# Altium project DIOT_Sampler.PrjPCB (part 5 of 5)

## Sheet CPCIS_Connectors_P1_P6.SchDoc
size 420 x 297 mm; Organization: WUT; DocumentNumber: 1; SheetNumber: 10; Title2: CPCIS Connectors; SPICEModelCacheRMUUFYQV: <root> / <DocumentId>RMUUFYQV</DocumentId> / </root>; ModifiedDate: -; Rule: PcbType=ProtelPcb; ProjectName: DIOT_Sampler.PrjPCB
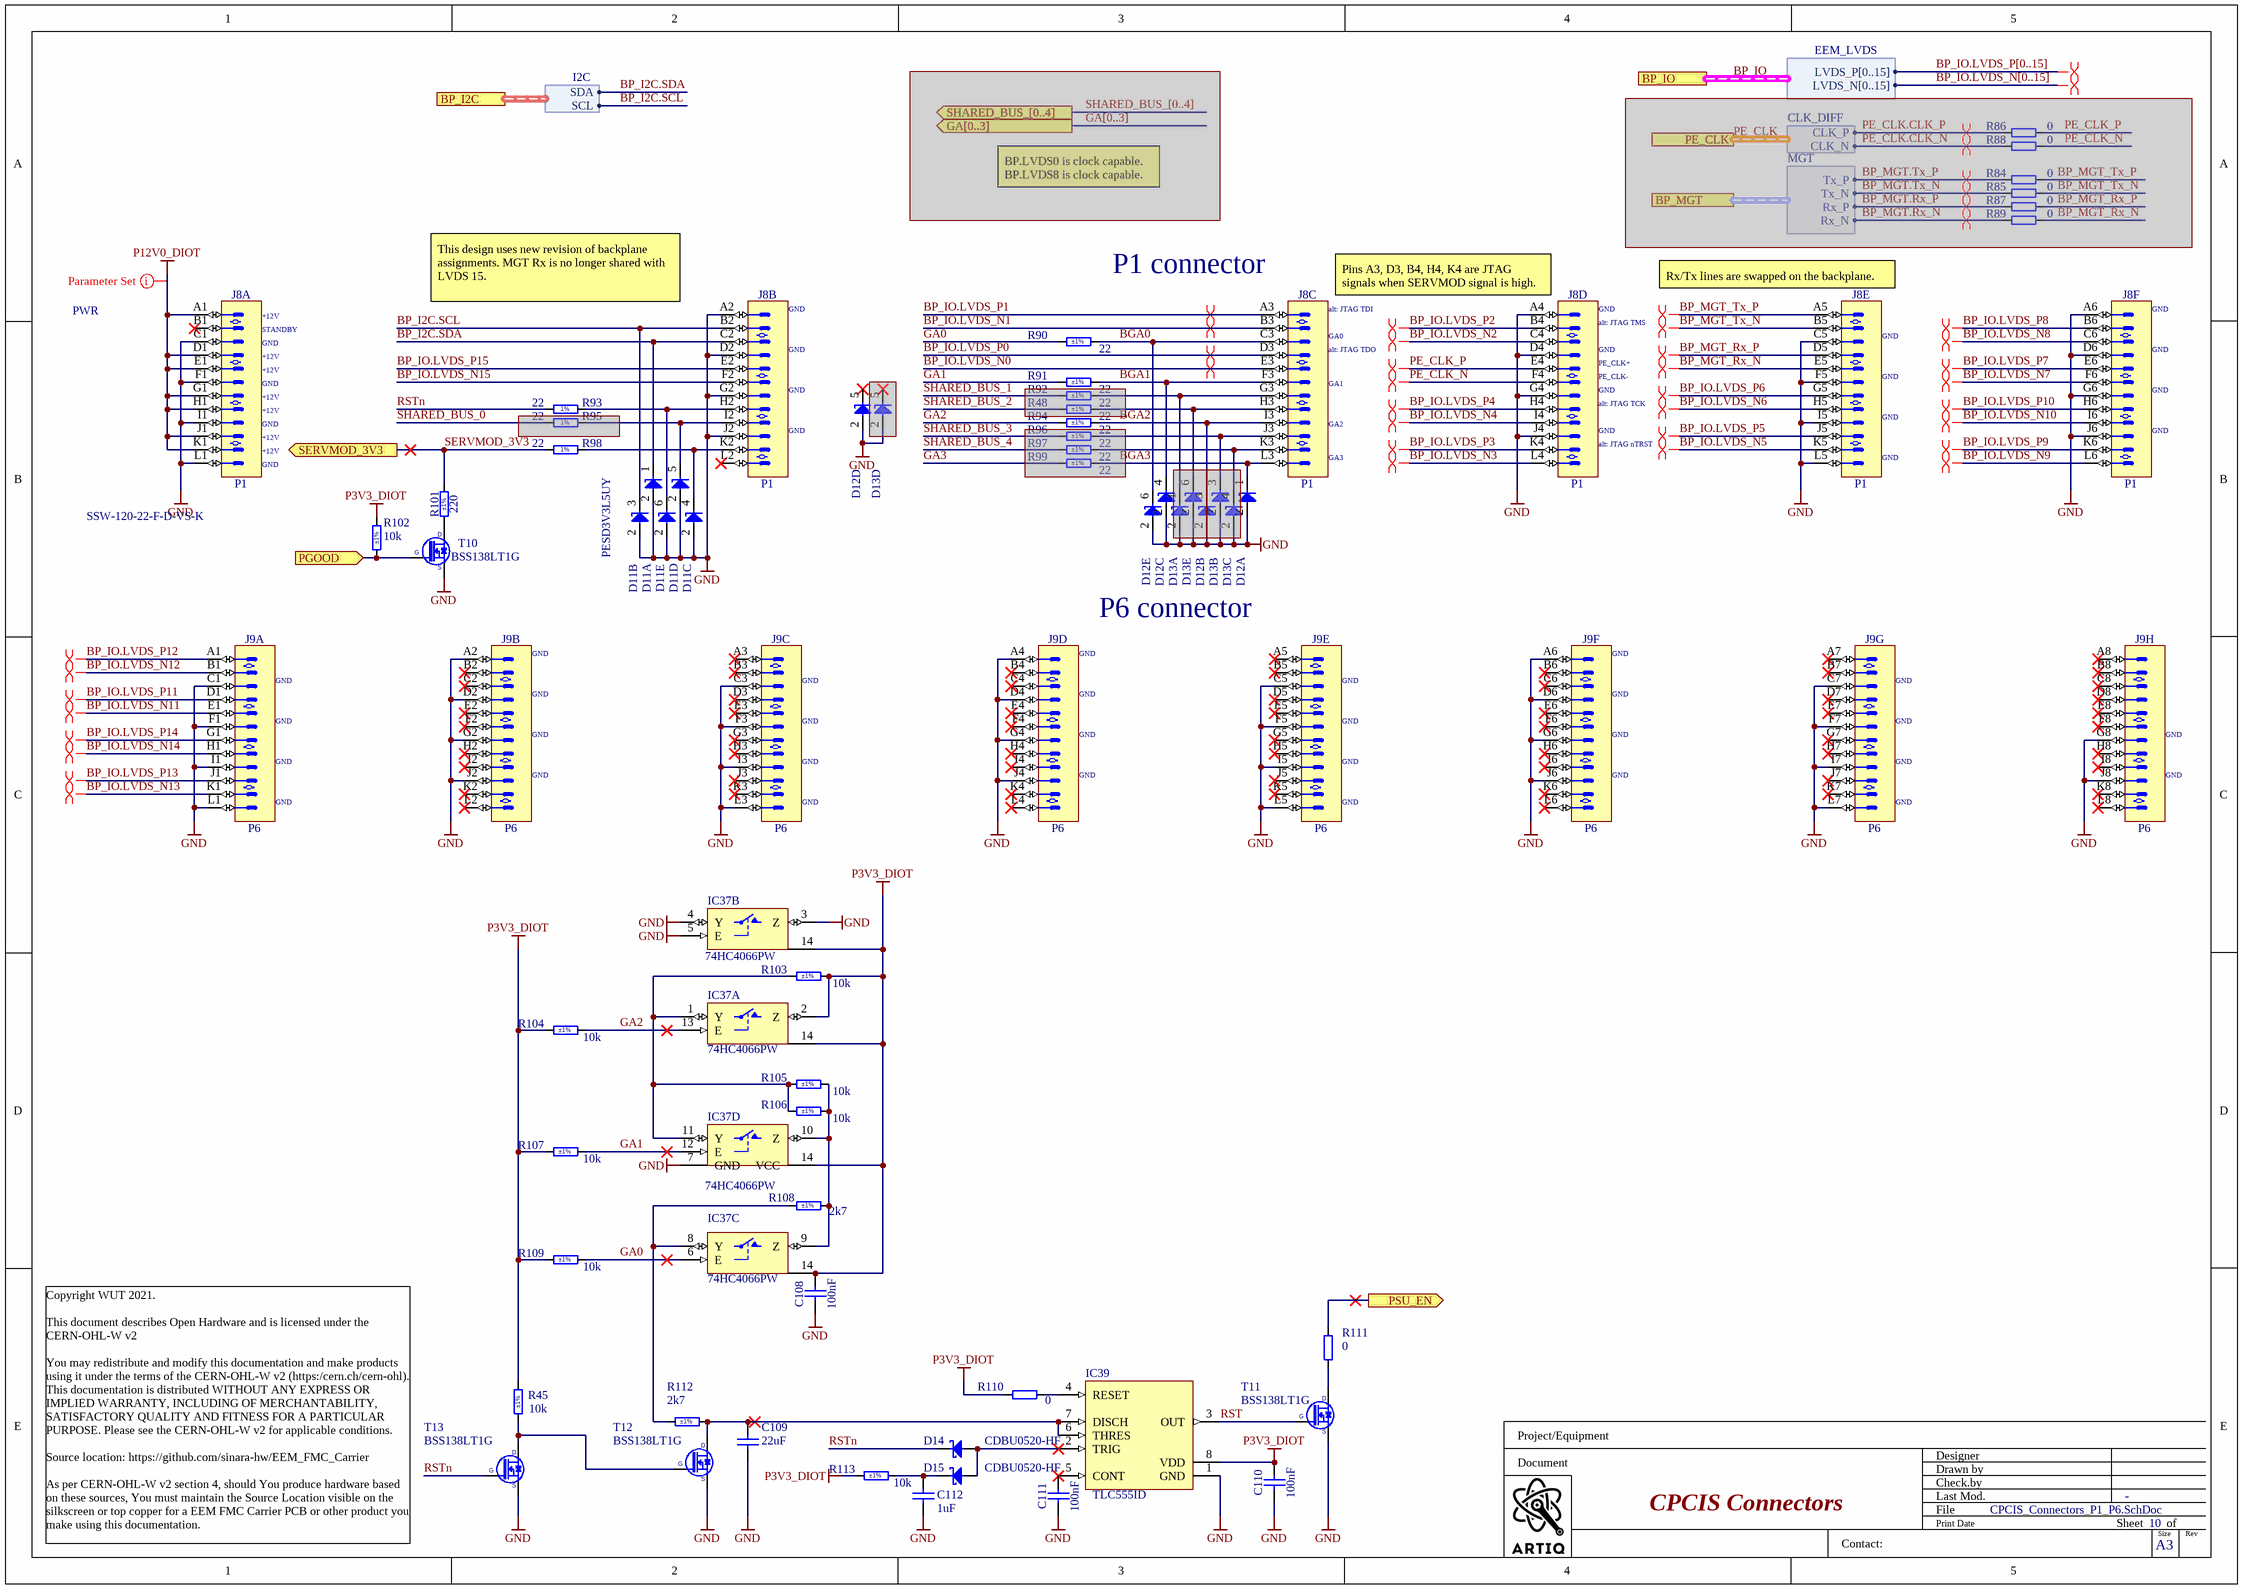
[diagram p6: CPCIS_Connectors_P1_P6.SchDoc]

### Parts
(Parts that share a designator on the sheet are numbered #1, #2 ... from top to bottom, then left to right.)
C108  100nF  [CAPC1005X55N]
C109  22uF  [CAPC2012X135N]
C110  100nF  [CAPC1005X55N]
C111  100nF  [CAPC1005X55N]
C112  1uF  [CAPC1005X55N]
D11  PESD3V3L5UY  [SOT65P210X110-6N]  (value not drawn)  (parts A,B,C,D,E of 5)
D12  PESD3V3L5UY  [SOT65P210X110-6N]  (value not drawn)  (parts A,B,C,D,E of 5)
D13  PESD3V3L5UY  [SOT65P210X110-6N]  (value not drawn)  (parts A,B,C,D,E of 5)  (masked out: inside a compile mask, not in the netlist)
D14  CDBU0520-HF  [SOD-523F]
D15  CDBU0520-HF  [SOD-523F]
IC37  74HC4066PW  [SOP65P640X110-14N]  (parts A,B,C,D of 4)
IC39  TLC555ID  [SOIC127P600X175-8N]
J8  P1  [AMPHENOL_10052825-101LF]  (parts A,B,C,D,E,F of 6)
J9  P6  [AMPHENOL_10052838-101LF]  (parts A,B,C,D,E,F,G,H of 8)
R45  10k  Tolerance: ±1%  [RESC1005X40N]
R48  22  Tolerance: ±1%  [RESC1005X40N]  (masked out: inside a compile mask, not in the netlist)
R84  0  [RESC1005X40N]  (masked out: inside a compile mask, not in the netlist)
R85  0  [RESC1005X40N]  (masked out: inside a compile mask, not in the netlist)
R86#2  0  [RESC1005X40N]  (masked out: inside a compile mask, not in the netlist)
R87  0  [RESC1005X40N]  (masked out: inside a compile mask, not in the netlist)
R88  0  [RESC1005X40N]  (masked out: inside a compile mask, not in the netlist)
R89  0  [RESC1005X40N]  (masked out: inside a compile mask, not in the netlist)
R90  22  Tolerance: ±1%  [RESC1005X40N]
R91  22  Tolerance: ±1%  [RESC1005X40N]
R92  22  Tolerance: ±1%  [RESC1005X40N]  (masked out: inside a compile mask, not in the netlist)
R93  22  [RESC1005X40N]
R94  22  Tolerance: ±1%  [RESC1005X40N]
R95  22  [RESC1005X40N]  (masked out: inside a compile mask, not in the netlist)
R96  22  Tolerance: ±1%  [RESC1005X40N]  (masked out: inside a compile mask, not in the netlist)
R97  22  Tolerance: ±1%  [RESC1005X40N]  (masked out: inside a compile mask, not in the netlist)
R98  22  [RESC1005X40N]
R99  22  Tolerance: ±1%  [RESC1005X40N]  (masked out: inside a compile mask, not in the netlist)
R101  220  Tolerance: ±1%  [RESC1005X40N]
R102  10k  Tolerance: ±1%  [RESC1005X40N]
R103  10k  Tolerance: ±1%  [RESC1005X40N]
R104  10k  Tolerance: ±1%  [RESC1005X40N]
R105  10k  Tolerance: ±1%  [RESC1005X40N]
R106  10k  Tolerance: ±1%  [RESC1005X40N]
R107  10k  Tolerance: ±1%  [RESC1005X40N]
R108  2k7  Tolerance: ±1%  [RESC1005X40N]
R109  10k  Tolerance: ±1%  [RESC1005X40N]
R110  0  [RESC1005X40N]
R111  0  [RESC1005X40N]
R112  2k7  Tolerance: ±1%  [RESC1005X40N]
R113  10k  Tolerance: ±1%  [RESC1005X40N]
T10  BSS138LT1G  [SOT95P240X110-3N]
T11  BSS138LT1G  [SOT95P240X110-3N]
T12  BSS138LT1G  [SOT95P240X110-3N]
T13  BSS138LT1G  [SOT95P240X110-3N]

### Ports
BP_I2C (harness I2C), BP_IO (harness EEM_LVDS), BP_MGT (harness MGT), GA[0..3] (out), PE_CLK (harness CLK_DIFF), PGOOD (in), PSU_EN (out), SERVMOD_3V3 (out), SHARED_BUS_[0..4] (out)

### Harnesses
MGT: Tx_P, Tx_N, Rx_P, Rx_N
CLK_DIFF: CLK_N, CLK_P
I2C: SDA, SCL
EEM_LVDS: LVDS_P[0..15], LVDS_N[0..15]

### Nets
GND: C108.1 C109.1 C110.1 C111.1 C112.1 D11.2(A) D12.2(A) IC37.3(Z) IC37.4(Y) IC37.5(E) IC37.7(GND) IC39.1(GND) J8.A2 J8.A4 J8.A6 J8.C1 J8.C5 J8.D2 J8.D4 J8.D6 J8.F1 J8.F5 J8.G2 J8.G4 J8.G6 J8.I1 J8.I5 J8.J2 J8.J4 J8.J6 J8.L1 J8.L5 J9.A2 J9.A4 J9.A6 J9.C1 J9.C3 J9.C5 J9.C7 J9.D2 J9.D4 J9.D6 J9.F1 J9.F3 J9.F5 J9.F7 J9.G2 J9.G4 J9.G6 J9.G8 J9.I1 J9.I3 J9.I5 J9.I7 J9.J2 J9.J4 J9.J6 J9.J8 J9.L1 J9.L3 J9.L5 J9.L7 T10.2(S) T11.2(S) T12.2(S) T13.2(S)
P3V3_DIOT: C108.2 C110.2 IC37.2(Z) IC37.14(VCC) IC39.8(VDD) R45.1 R102.2 R103.2 R104.1 R107.1 R109.1 R110.1 R113.1
P12V0_DIOT: J8.A1 J8.D1 J8.E1 J8.G1 J8.H1 J8.J1 J8.K1
BGA0: D12.6(C) J8.C3 R90.2
BGA1: D12.4(C) J8.F3 R91.2
BGA2: J8.I3 R94.2
BP_I2C.SCL: D11.3(C) J8.B2 ; port BP_I2C.SCL
BP_I2C.SDA: D11.1(C) J8.C2 ; port BP_I2C.SDA
BP_IO.LVDS_N0: J8.E3
BP_IO.LVDS_N1: J8.B3
BP_IO.LVDS_N2: J8.C4
BP_IO.LVDS_N3: J8.L4
BP_IO.LVDS_N4: J8.I4
BP_IO.LVDS_N5: J8.K5
BP_IO.LVDS_N6: J8.H5
BP_IO.LVDS_N7: J8.F6
BP_IO.LVDS_N8: J8.C6
BP_IO.LVDS_N9: J8.L6
BP_IO.LVDS_N10: J8.I6
BP_IO.LVDS_N11: J9.E1
BP_IO.LVDS_N12: J9.B1
BP_IO.LVDS_N13: J9.K1
BP_IO.LVDS_N14: J9.H1
BP_IO.LVDS_N15: J8.F2
BP_IO.LVDS_P0: J8.D3
BP_IO.LVDS_P1: J8.A3
BP_IO.LVDS_P2: J8.B4
BP_IO.LVDS_P3: J8.K4
BP_IO.LVDS_P4: J8.H4
BP_IO.LVDS_P5: J8.J5
BP_IO.LVDS_P6: J8.G5
BP_IO.LVDS_P7: J8.E6
BP_IO.LVDS_P8: J8.B6
BP_IO.LVDS_P9: J8.K6
BP_IO.LVDS_P10: J8.H6
BP_IO.LVDS_P11: J9.D1
BP_IO.LVDS_P12: J9.A1
BP_IO.LVDS_P13: J9.J1
BP_IO.LVDS_P14: J9.G1
BP_IO.LVDS_P15: J8.E2
BP_MGT_Rx_N: J8.E5
BP_MGT_Rx_P: J8.D5
BP_MGT_Tx_N: J8.B5
BP_MGT_Tx_P: J8.A5
GA0: IC37.6(E) R90.1 R109.2
GA1: IC37.12(E) R91.1 R107.2
GA2: IC37.13(E) R94.1 R104.2
PE_CLK_N: J8.F4
PE_CLK_P: J8.E4
PSU_EN: R111.2 ; port PSU_EN
RST: IC39.3(OUT) T11.1(G)
RSTn: D14.1(C) R93.1 T13.1(G)
SERVMOD_3V3: R98.1 R101.2 ; port SERVMOD_3V3
NetC109_2: C109.2 IC39.6(THRES) IC39.7(DISCH) R112.2 T12.3(D)
NetC111_2: C111.2 IC39.5(CONT)
NetC112_2: C112.2 D15.1(C) R113.2
NetD11_4: D11.4(C) J8.K2 R98.2
NetD11_5: D11.5(C) J8.I2
NetD11_6: D11.6(C) J8.H2 R93.2
NetD12_1: D12.1(C) J8.L3
NetD14_2: D14.2(A) D15.2(A) IC39.2(TRIG)
NetIC37_1: IC37.1(Y) IC37.11(Y) R103.1 R105.1 R106.1
NetIC37_8: IC37.8(Y) R108.1 R112.1
NetIC37_9: IC37.9(Z) IC37.10(Z) R105.2 R106.2 R108.2
NetIC39_4: IC39.4(RESET) R110.2
NetR45_2: R45.2 T12.1(G) T13.3(D)
NetR101_1: R101.1 T10.3(D)
NetR102_1: R102.1 T10.1(G) ; port PGOOD
NetR111_1: R111.1 T11.3(D)

Not connected (* = marked no-connect by the designer): D12 5(C)*; J8 B1* G3 H3 J3 K3 L2*; J9 A3* A5* A7* A8* B2* B3* B4* B5* B6* B7* B8* C2* C4* C6* C8* D3* D5* D7* D8* E2* E3* E4* E5* E6* E7* E8* F2* F4* F6* F8* G3* G5* G7* H2* H3* H4* H5* H6* H7* H8* I2* I4* I6* I8* J3* J5* J7* K2* K3* K4* K5* K6* K7* K8* L2* L4* L6* L8*

### Buses and harness runs
bus BP_IO.LVDS_N[0..15]
bus BP_IO.LVDS_P[0..15]
harness BP_IO = port BP_IO

### Layout directives
differential pair: (no net found under the mark), BP_IO.LVDS_N0, BP_IO.LVDS_N1, BP_IO.LVDS_N2, BP_IO.LVDS_N3, BP_IO.LVDS_N4, BP_IO.LVDS_N5, BP_IO.LVDS_N6, BP_IO.LVDS_N7, BP_IO.LVDS_N8, BP_IO.LVDS_N9, BP_IO.LVDS_N10, BP_IO.LVDS_N11, BP_IO.LVDS_N12, BP_IO.LVDS_N13, BP_IO.LVDS_N14, BP_IO.LVDS_P0, BP_IO.LVDS_P1, BP_IO.LVDS_P2, BP_IO.LVDS_P3, BP_IO.LVDS_P4, BP_IO.LVDS_P5, BP_IO.LVDS_P6, BP_IO.LVDS_P7, BP_IO.LVDS_P8, BP_IO.LVDS_P9, BP_IO.LVDS_P10, BP_IO.LVDS_P11, BP_IO.LVDS_P12, BP_IO.LVDS_P13, BP_IO.LVDS_P14
differential pair; differential pair class Diff_100Ohm: (no net found under the mark), PE_CLK_N, PE_CLK_P
differential pair; differential pair class MGT: (no net found under the mark), BP_MGT_Rx_N, BP_MGT_Rx_P, BP_MGT_Tx_N, BP_MGT_Tx_P
net class PWR: P12V0_DIOT

### Notes on the sheet
- BP.LVDS0 is clock capable.
  BP.LVDS8 is clock capable.
- (near J8) +12V
- This design uses new revision of backplane assignments. MGT Rx is no longer shared with LVDS 15.
- (near J8) GND
- (near J8) P1 connector
- (near J8) alt: JTAG TDI
- (near J8) Pins A3, D3, B4, H4, K4 are JTAG signals when SERVMOD signal is high.
- (near J8) alt: JTAG TMS
- (near J8) Rx/Tx lines are swapped on the backplane.
- (near J8) STANDBY
- GND
- (near J8) alt: JTAG TDO
- (near J8) GA1
- (near J8) GA0
- (near J8) PE_CLK+
- (near J8) PE_CLK-
- (near J8) GA2
- (near J8) GA3
- (near J8) alt: JTAG TCK
- (near J8) alt: JTAG nTRST
- (near J8) SSW-120-22-F-D-VS-K
- (near J9) GND
- (near J9) P6 connector
- Project/Equipment
- Document
- Designer
- Drawn by
- Check.by
- Copyright WUT 2021.
  This document describes Open Hardware and is licensed under the CERN-OHL-W v2
  You may redistribute and modify this documentation and make products using it under the terms of the CERN-OHL-W v2 (https:/cern.ch/cern-ohl). This documentation is distributed WITHOUT ANY EXPRESS OR IMPLIED WARRANTY, INCLUDING OF MERCHANTABILITY, SATISFACTORY QUALITY AND FITNESS FOR A PARTICULAR PURPOSE. Please see the CERN-OHL-W v2 for applicable conditions.
  Source location: https://github.com/sinara-hw/EEM_FMC_Carrier
  As per CERN-OHL-W v2 section 4, should You produce hardware based on these sources, You must maintain the Source Location visible on the silkscreen or top copper for a EEM FMC Carrier PCB or other product you make using this documentation.
- Contact:
- File
- Last Mod.
- Print Date
- Sheet
- Size
- A3
- of
- Rev
- (in symbol R0402_22R_1%_0.0625W_100PPM) 1%

### Library data of the parts
C108 C110 C111 = CC0402_100NF_16V_10%_X5R: Non-polarised capacitor; Part Description: SMD Multilayer Chip Ceramic Capacitor; Manufacturer: GENERIC; Manufacturer1 Part Number: GRM155R61C104KA88D; Voltage: 16V; TC: X5R; Tolerance: ±10%; Part Number: CC0402_100NF_16V_10%_X5R; Component Kind: Standard; Component Type: Standard; Pin Count: 2; Value: 100nF; Status: None; Manufacturer Part Number: CC0402_100NF_16V_10%_X5R; Case: 0402; Mounted: Yes; Socket: No; SMD: Yes; Sense: No; Manufacturer1 Example: MURATA; Manufacturer1 ComponentHeight: 0.55mm; HelpURL: \\cern.ch\dfs\Applications\Altium\Datasheets\CC0402_X5R_MURATA_GRM.pdf; Author: CERN DEM JLC; CreateDate: 10.12.2013; LatestRevisionDate: 10.12.2013
C109 = CC0805_22UF_16V_10%_X5R: Non-polarised capacitor; Part Description: SMD Multilayer Chip Ceramic Capacitor; Manufacturer: GENERIC; Manufacturer1 Part Number: C2012X5R1C226KT; Voltage: 16V; TC: X5R; Tolerance: ±10%; Part Number: CC0805_22UF_16V_10%_X5R; Component Kind: Standard; Component Type: Standard; Pin Count: 2; Value: 22uF; Status: Preferred; Manufacturer Part Number: CC0805_22UF_16V_10%_X5R; Case: 0805; Mounted: Yes; Socket: No; SMD: Yes; Sense: No; Manufacturer1 Example: TDK; Manufacturer1 ComponentHeight: 1.35mm; HelpURL: \\cern.ch\dfs\Applications\Altium\Datasheets\CC0805_X5R_TDK_C.pdf; Author: CERN DEM JLC; CreateDate: 25.10.2012; LatestRevisionDate: 25.10.2012
C112 = CC0402_1UF_16V_10%_X5R: Non-polarised capacitor; Part Description: SMD Multilayer Chip Ceramic Capacitor; Manufacturer: GENERIC; Manufacturer1 Part Number: C1005X5R1C105KT; Voltage: 16V; TC: X5R; Tolerance: ±10%; Part Number: CC0402_1UF_16V_10%_X5R; Component Kind: Standard; Component Type: Standard; Pin Count: 2; Value: 1uF; Status: Preferred; Manufacturer Part Number: CC0402_1UF_16V_10%_X5R; Case: 0402; Mounted: Yes; Socket: No; SMD: Yes; Sense: No; Manufacturer1 Example: TDK; Manufacturer1 ComponentHeight: 0.55mm; HelpURL: \\cern.ch\dfs\Applications\Altium\Datasheets\CC0402_X5R_TDK_C.pdf; Author: CERN DEM JLC; CreateDate: 25.10.2012; LatestRevisionDate: 25.10.2012
D11-D13 = PESD3V3L5UY: Fivefold ESD Protection Diode Arrays; Part Description: Fivefold ESD Protection Diode Arrays (30kV); Manufacturer: NEXPERIA; Voltage: 3.3V; Power: 200W; PressFit: No; Bonding: No; Part Number: PESD3V3L5UY; Component Kind: Standard; Component Type: Standard; Device: PESD3V3L5UY; PackageDescription: SOT363, SC-88, 0.65mm Pitch; 6 Pin, 1.25mm W X 2.00mm L X 1.10mm H body, IPC Medium Density; Manufacturer Part Number: PESD3V3L5UY; Pin Count: 6; Case: SOT363; Mounted: Yes; Socket: No; SMD: Yes; Sense: No; ComponentHeight: 1.1mm; HelpURL: \\cern.ch\dfs\Applications\Altium\Datasheets\PESD3V3L5UY.pdf; Author: CERN DEM WB; CreateDate: 05.07.2021; LatestRevisionDate: 05.07.2021
D14 D15 = CDBU0520-HF: Schottky Diode; Part Description: 20V Surface mount Schottky Barrier Diode; Manufacturer: COMCHIP; Voltage: 20V; Power: 500mA; PressFit: No; Bonding: No; Part Number: CDBU0520-HF; Component Kind: Standard; Component Type: Standard; Device: CDBU0520-HF; PackageDescription: Small Outline Diode Flat Lead (SOD-523F), Body; 1.80mm L X 1mm W X 0.85mm H; Manufacturer Part Number: CDBU0520-HF; Pin Count: 2; Case: SOD-523F; Mounted: Yes; Socket: No; SMD: Yes; Sense: No; ComponentHeight: 1mm; HelpURL: \\cern.ch\dfs\Applications\Altium\Datasheets\CDBU0520-HF.pdf; Author: CERN DEM HF; CreateDate: 13.10.2023; LatestRevisionDate: 13.10.2023
IC37 = 74HC4066PW: Part Description: Quad Single-Pole Single-Throw Analog Switch; Manufacturer: NXP SEMICONDUCTORS; PressFit: No; Bonding: No; Table: Standard Logic; Part Number: 74HC4066PW; Component Kind: Standard; Component Type: Standard; Device: 74HC4066PW; PackageDescription: SOP, 14-Leads, Body 4.4x5mm (max), Pitch 0.65mm, IPC Medium Density; Manufacturer Part Number: 74HC4066PW; Pin Count: 14; Case: TSSOP14; Mounted: Yes; Socket: No; SMD: Yes; ComponentHeight: 1.1mm; Author: CERN DEM JLC; HelpURL: \\cern.ch\dfs\Applications\Altium\Datasheets\74HC4066PW.pdf; CreateDate: 2014-11-19; LatestRevisionDate: 2014-11-19
IC39 = TLC555ID: LinCMOS Timer; Manufacturer: TEXAS INSTRUMENTS; PressFit: No; Bonding: No; Part Number: TLC555ID; Component Kind: Standard; Component Type: Standard; Device: TLC555ID; PackageDescription: SOIC 8, Pitch 1.27mm, Body 4x5mm, IPC Medium Density; Part Description: LinCMOS Timer; Manufacturer Part Number: TLC555ID; Pin Count: 8; Case: SOIC8; Mounted: Yes; Socket: No; SMD: Yes; Sense: No; ComponentHeight: 1.75mm; Author: CERN DEM JMW; HelpURL: \\cern.ch\dfs\Applications\Altium\Datasheets\TLC555ID.pdf; CreateDate: 23.08.2016; LatestRevisionDate: 23.08.2016
J8 = AMPHENOL_10052825-101LF: 72 Contacts Header, 6 Columns, 4 Pairs per Column; Part Description: 72 Contacts, 2mm Pitch, 6 Columns, 4 Pairs per Column, 4 Walls, Right Angle Header; Part Number: AMPHENOL_10052825-101LF; Component Kind: Standard; Component Type: Standard; Pin Count: 72; Family: AirMax VS; Mounted: Yes; Socket: No; SMD: No; PressFit: Yes; Sense: No; Status: None; Manufacturer: AMPHENOL; Manufacturer Part Number: 10052825-101LF; ComponentHeight: 15.35mm; HelpURL: \\cern.ch\dfs\Applications\Altium\Datasheets\AMPHENOL_10052825-101LF.pdf; ComponentLink1URL: \\cern.ch\dfs\Applications\Altium\Datasheets\AMPHENOL_10052825-101LF_Application.pdf; ComponentLink1Description: Application; Author: CERN DEM MR; CreateDate: 19/02/2018; LatestRevisionDate: 19/02/2018; Classname: Overlapping
J9 = AMPHENOL_10052838-101LF: 96 Contacts Header, 8 Columns, 4 Pairs per Column; Part Description: 96 Contacts, 2mm Pitch, 8 Columns, 4 Pairs per Column, 4 Walls, Right Angle Header; Part Number: AMPHENOL_10052838-101LF; Component Kind: Standard; Component Type: Standard; Pin Count: 96; Family: AirMax VS; Mounted: Yes; Socket: No; SMD: No; PressFit: Yes; Sense: No; Status: None; Manufacturer: AMPHENOL; Manufacturer Part Number: 10052838-101LF; ComponentHeight: 15.35mm; HelpURL: \\cern.ch\dfs\Applications\Altium\Datasheets\AMPHENOL_10052838-101LF.pdf; ComponentLink1URL: \\cern.ch\dfs\Applications\Altium\Datasheets\AMPHENOL_10052838-101LF_Application.pdf; ComponentLink1Description: Application; Author: CERN DEM MR; CreateDate: 19.02.2018; LatestRevisionDate: 19.02.2018
R45 R102-R107 R109 R113 = R0402_10K_1%_0.0625W_100PPM: Resistor - 1%; Part Description: General Purpose Thick Film Chip Resistor; Manufacturer: GENERIC; Manufacturer1 Part Number: 232270671003L; TC: ±100ppm/°C; PressFit: No; Part Number: R0402_10K_1%_0.0625W_100PPM; Component Kind: Standard; Component Type: Standard; Pin Count: 2; Value: 10k; Status: Not Recommended; Power: 0.0625W; Manufacturer Part Number: R0402_10K_1%_0.0625W_100PPM; Case: 0402; Mounted: Yes; Sense: No; Socket: No; SMD: Yes; Manufacturer1 Example: YAGEO PHYCOMP; Manufacturer1 ComponentHeight: 0.4mm; HelpURL: \\cern.ch\dfs\Applications\Altium\Datasheets\R0402_Phycomp_RC0402.pdf; Author: CERN DEM JLC; CreateDate: 03.12.2007; LatestRevisionDate: 17.10.2012
R48 R90-R92 R94 R96 R97 R99 = R0402_22R_1%_0.0625W_100PPM: Resistor - 1%; Part Description: General Purpose Thick Film Chip Resistor; Manufacturer: GENERIC; Manufacturer1 Part Number: 232270672209L; TC: ±100ppm/°C; PressFit: No; Part Number: R0402_22R_1%_0.0625W_100PPM; Component Kind: Standard; Component Type: Standard; Pin Count: 2; Value: 22; Status: Not Recommended; Power: 0.0625W; Manufacturer Part Number: R0402_22R_1%_0.0625W_100PPM; Case: 0402; Mounted: Yes; Sense: No; Socket: No; SMD: Yes; Manufacturer1 Example: YAGEO PHYCOMP; Manufacturer1 ComponentHeight: 0.4mm; HelpURL: \\cern.ch\dfs\Applications\Altium\Datasheets\R0402_Phycomp_RC0402.pdf; Author: CERN DEM JLC; CreateDate: 03.12.2007; LatestRevisionDate: 17.10.2012
R84 R85 R86#2 R87-R89 R110 R111 = R0402_0R_JUMPER: Resistor; Part Description: 1A (0.05R Max DC Resistance) Zero Ohm Jumper; Manufacturer: GENERIC; Manufacturer1 Part Number: 232270591001L; PressFit: No; Part Number: R0402_0R_JUMPER; Component Kind: Standard; Component Type: Standard; Pin Count: 2; Value: 0; Status: Not Recommended; Manufacturer Part Number: R0402_0R_JUMPER; Case: 0402; Mounted: Yes; Sense: No; Socket: No; SMD: Yes; Manufacturer1 Example: YAGEO PHYCOMP; Manufacturer1 ComponentHeight: 0.4mm; HelpURL: \\cern.ch\dfs\Applications\Altium\Datasheets\R0402_Phycomp_RC0402.pdf; Author: CERN DEM JLC; CreateDate: 03.12.2007; LatestRevisionDate: 17.10.2012
R93 R95 R98 = R0402_22R_1%_0.0625W_100PPM: Resistor - 1%; Part Description: General Purpose Thick Film Chip Resistor; Manufacturer: GENERIC; Manufacturer1 Part Number: 232270672209L; PressFit: No; Part Number: R0402_22R_1%_0.0625W_100PPM; Component Kind: Standard; Component Type: Standard; Pin Count: 2; Value: 22; Status: Not Recommended; Power: 0.0625W; Tolerance: ±1%; Manufacturer Part Number: R0402_22R_1%_0.0625W_100PPM; Case: 0402; Mounted: Yes; Socket: No; SMD: Yes; Manufacturer1 Example: YAGEO PHYCOMP; Manufacturer1 ComponentHeight: 0.4mm; HelpURL: \\cern.ch\dfs\Applications\Altium\Datasheets\R0402_Phycomp_RC0402.pdf; Author: CERN DEM JLC; CreateDate: 03.12.2007; LatestRevisionDate: 17.10.2012; Sense: No
R101 = R0402_220R_1%_0.0625W_100PPM: Resistor - 1%; Part Description: General Purpose Thick Film Chip Resistor; Manufacturer: GENERIC; Manufacturer1 Part Number: 232270672201L; TC: ±100ppm/°C; PressFit: No; Part Number: R0402_220R_1%_0.0625W_100PPM; Component Kind: Standard; Component Type: Standard; Pin Count: 2; Value: 220; Status: Not Recommended; Power: 0.0625W; Manufacturer Part Number: R0402_220R_1%_0.0625W_100PPM; Case: 0402; Mounted: Yes; Sense: No; Socket: No; SMD: Yes; Manufacturer1 Example: YAGEO PHYCOMP; Manufacturer1 ComponentHeight: 0.4mm; HelpURL: \\cern.ch\dfs\Applications\Altium\Datasheets\R0402_Phycomp_RC0402.pdf; Author: CERN DEM JLC; CreateDate: 03.12.2007; LatestRevisionDate: 17.10.2012
R108 R112 = R0603_2K7_1%_0.1W_100PPM: Resistor - 1%; Part Description: General Purpose Thick Film Chip Resistor; Manufacturer: GENERIC; Manufacturer1 Part Number: RC0603FR-072K7L; Power: 0.1W; TC: ±100ppm/°C; PressFit: No; Part Number: R0603_2K7_1%_0.1W_100PPM; Component Kind: Standard; Component Type: Standard; Footprint: RESC1608X55N; Pin Count: 2; Value: 2k7; Status: Preferred; Manufacturer Part Number: R0603_2K7_1%_0.1W_100PPM; Case: 0603; Mounted: Yes; Sense: No; Socket: No; SMD: Yes; Manufacturer1 Example: YAGEO PHYCOMP; Manufacturer1 ComponentHeight: 0.55mm; HelpURL: \\cern.ch\dfs\Applications\Altium\Datasheets\R0603_PHYCOMP_RC0603.pdf; Author: CERN DEM JLC; CreateDate: 02.05.2011; LatestRevisionDate: 02.05.2011
T10-T13 = BSS138LT1G: N-CHANNEL MOSFET WITH DIODE; Part Description: 50V, 200mA N-Channel Enhancement Mode Field-Effect Transistor; Manufacturer: ON SEMICONDUCTOR; PressFit: No; Bonding: No; Part Number: BSS138LT1G; Component Kind: Standard; Component Type: Standard; Device: BSS138LT1G; PackageDescription: SOT23, 0.95mm Pitch; 3 Pin, 1.40mm W X 3.00mm L X 1.10mm H body, IPC Medium Density; Manufacturer Part Number: BSS138L; Pin Count: 3; Case: SOT23-3; Mounted: Yes; Socket: No; SMD: Yes; Sense: No; ComponentHeight: 1.11mm; HelpURL: \\cern.ch\dfs\Applications\Altium\Datasheets\BSS138LT1G.pdf; Author: CERN DEM JLC; CreateDate: 23.03.2009; LatestRevisionDate: 25.05.2022

## Nets that join several sheets
GND: Sampler (49 pins), ADC_8CH (41 pins), EEM_Connectors (77 pins), Supply_Sampler (78 pins), U_Input_channel (17 pins), U_Input_channel (17 pins), U_Input_channel (17 pins), U_Input_channel (17 pins), U_Input_channel (17 pins), U_Input_channel (17 pins), U_Input_channel (17 pins), U_Input_channel (17 pins), DIOT_Power_Supplies (14 pins), CPCIS_Connectors_P1_P6 (66 pins)
N12V0A: ADC_8CH (C105.2 IC35.4), Supply_Sampler (9 pins), U_Input_channel (8 pins), U_Input_channel (8 pins), U_Input_channel (8 pins), U_Input_channel (8 pins), U_Input_channel (8 pins), U_Input_channel (8 pins), U_Input_channel (8 pins), U_Input_channel (8 pins)
N13V0: Sampler (R42.2), Supply_Sampler (7 pins)
P2V5A: ADC_8CH (7 pins), EEM_Connectors (C16.2 IC7.1), Supply_Sampler (8 pins)
P3V3: Sampler (23 pins), EEM_Connectors (33 pins), Supply_Sampler (10 pins)
P3V3_DIOT: DIOT_Power_Supplies (C118.1 D17.2 IC41.5), CPCIS_Connectors_P1_P6 (13 pins)
P3V3_MP: EEM_Connectors (9 pins), DIOT_Power_Supplies (7 pins)
P3V3_MP2: Sampler (D22.2), EEM_Connectors (5 pins)
P5V0A: ADC_8CH (10 pins), Supply_Sampler (6 pins)
P12V0: Sampler (R86#1.2), EEM_Connectors (8 pins), Supply_Sampler (C57.2 IC27.8 L4.1), DIOT_Power_Supplies (6 pins)
P12V0_DIOT: EEM_Connectors (R100.1 R154.1 R155.1 R156.1), DIOT_Power_Supplies (C117.2 IC41.1 IC41.3), CPCIS_Connectors_P1_P6 (7 pins)
P12V0A: ADC_8CH (C104.2 IC35.8), Supply_Sampler (7 pins), U_Input_channel (7 pins), U_Input_channel (7 pins), U_Input_channel (7 pins), U_Input_channel (7 pins), U_Input_channel (7 pins), U_Input_channel (7 pins), U_Input_channel (7 pins), U_Input_channel (7 pins)
P13V0: Sampler (R41.2), Supply_Sampler (9 pins)
REF_P1V7066: ADC_8CH (IC35.7 R83.2 RN3.7), U_Input_channel (R7H.1 RN2H.5 RN2H.8), U_Input_channel (R7G.1 RN2G.5 RN2G.8), U_Input_channel (R7F.1 RN2F.5 RN2F.8), U_Input_channel (R7E.1 RN2E.5 RN2E.8), U_Input_channel (R7D.1 RN2D.5 RN2D.8), U_Input_channel (R7C.1 RN2C.5 RN2C.8), U_Input_channel (R7B.1 RN2B.5 RN2B.8), U_Input_channel (R7A.1 RN2A.5 RN2A.8)
REF_P2V048: ADC_8CH (IC35.1 RN3.3 RN4.6), U_Input_channel (R13H.1), U_Input_channel (R13G.1), U_Input_channel (R13F.1), U_Input_channel (R13E.1), U_Input_channel (R13D.1), U_Input_channel (R13C.1), U_Input_channel (R13B.1), U_Input_channel (R13A.1)
REF_P4V096: ADC_8CH (6 pins), Supply_Sampler (R59.1)
REF_VCC: ADC_8CH (R80.1), Supply_Sampler (8 pins)
ADC_CLKOUT_N: ADC_8CH (IC36.34), EEM_Connectors (IC13.8 R20.2)
ADC_CLKOUT_P: ADC_8CH (IC36.33), EEM_Connectors (IC13.1 R20.1)
ADC_IN_N0: Sampler (P1.2 P5.23), U_Input_channel (L1A.2 R8A.1 SW1A.1)
ADC_IN_N1: Sampler (J4.2 P5.20), U_Input_channel (L1B.2 R8B.1 SW1B.1)
ADC_IN_N2: Sampler (P1.6 P5.17), U_Input_channel (L1C.2 R8C.1 SW1C.1)
ADC_IN_N3: Sampler (J5.2 P5.14), U_Input_channel (L1D.2 R8D.1 SW1D.1)
ADC_IN_N4: Sampler (P2.2 P5.11), U_Input_channel (L1E.2 R8E.1 SW1E.1)
ADC_IN_N5: Sampler (J6.2 P5.8), U_Input_channel (L1F.2 R8F.1 SW1F.1)
ADC_IN_N6: Sampler (P2.6 P5.5), U_Input_channel (L1G.2 R8G.1 SW1G.1)
ADC_IN_N7: Sampler (J7.2 P5.2), U_Input_channel (L1H.2 R8H.1 SW1H.1)
ADC_IN_P0: Sampler (P1.1 P5.22), U_Input_channel (L1A.1 R1A.1 R5A.2)
ADC_IN_P1: Sampler (J4.1 P5.19), U_Input_channel (L1B.1 R1B.1 R5B.2)
ADC_IN_P2: Sampler (P1.5 P5.16), U_Input_channel (L1C.1 R1C.1 R5C.2)
ADC_IN_P3: Sampler (J5.1 P5.13), U_Input_channel (L1D.1 R1D.1 R5D.2)
ADC_IN_P4: Sampler (P2.1 P5.10), U_Input_channel (L1E.1 R1E.1 R5E.2)
ADC_IN_P5: Sampler (J6.1 P5.7), U_Input_channel (L1F.1 R1F.1 R5F.2)
ADC_IN_P6: Sampler (P2.5 P5.4), U_Input_channel (L1G.1 R1G.1 R5G.2)
ADC_IN_P7: Sampler (J7.1 P5.1), U_Input_channel (L1H.1 R1H.1 R5H.2)
ADC_SCK_N: ADC_8CH (IC36.42 R79.1), EEM_Connectors (IC4.5)
ADC_SCK_P: ADC_8CH (IC36.41 R79.2), EEM_Connectors (IC4.6)
ADC_SDOA_N: ADC_8CH (IC36.28), EEM_Connectors (IC5.1 IC14.1 R21.1)
ADC_SDOA_P: ADC_8CH (IC36.27), EEM_Connectors (IC5.8 IC14.8 R21.2)
ADC_SDOB_N: ADC_8CH (IC36.30), EEM_Connectors (IC15.8 R22.2)
ADC_SDOB_P: ADC_8CH (IC36.29), EEM_Connectors (IC15.1 R22.1)
ADC_SDOC_N: ADC_8CH (IC36.36), EEM_Connectors (IC16.8 R23.2)
ADC_SDOC_P: ADC_8CH (IC36.35), EEM_Connectors (IC16.1 R23.1)
ADC_SDOD_N: ADC_8CH (IC36.40), EEM_Connectors (IC17.8 R24.2)
ADC_SDOD_P: ADC_8CH (IC36.39), EEM_Connectors (IC17.1 R24.1)
BP_I2C.SCL: EEM_Connectors (R121.1), CPCIS_Connectors_P1_P6 (D11.3 J8.B2)
BP_I2C.SDA: EEM_Connectors (R120.1), CPCIS_Connectors_P1_P6 (D11.1 J8.C2)
BP_IO.LVDS_N0: EEM_Connectors (R138.1), CPCIS_Connectors_P1_P6 (J8.E3)
BP_IO.LVDS_N1: EEM_Connectors (R139.1), CPCIS_Connectors_P1_P6 (J8.B3)
BP_IO.LVDS_N2: EEM_Connectors (R140.1), CPCIS_Connectors_P1_P6 (J8.C4)
BP_IO.LVDS_N3: EEM_Connectors (R141.1), CPCIS_Connectors_P1_P6 (J8.L4)
BP_IO.LVDS_N4: EEM_Connectors (R142.1), CPCIS_Connectors_P1_P6 (J8.I4)
BP_IO.LVDS_N5: EEM_Connectors (R143.1), CPCIS_Connectors_P1_P6 (J8.K5)
BP_IO.LVDS_N6: EEM_Connectors (R144.1), CPCIS_Connectors_P1_P6 (J8.H5)
BP_IO.LVDS_N7: EEM_Connectors (R145.1), CPCIS_Connectors_P1_P6 (J8.F6)
BP_IO.LVDS_N8: EEM_Connectors (R146.1), CPCIS_Connectors_P1_P6 (J8.C6)
BP_IO.LVDS_N9: EEM_Connectors (R147.1), CPCIS_Connectors_P1_P6 (J8.L6)
BP_IO.LVDS_N10: EEM_Connectors (R148.1), CPCIS_Connectors_P1_P6 (J8.I6)
BP_IO.LVDS_N11: EEM_Connectors (R149.1), CPCIS_Connectors_P1_P6 (J9.E1)
BP_IO.LVDS_P0: EEM_Connectors (R122.1), CPCIS_Connectors_P1_P6 (J8.D3)
BP_IO.LVDS_P1: EEM_Connectors (R123.1), CPCIS_Connectors_P1_P6 (J8.A3)
BP_IO.LVDS_P2: EEM_Connectors (R124.1), CPCIS_Connectors_P1_P6 (J8.B4)
BP_IO.LVDS_P3: EEM_Connectors (R125.1), CPCIS_Connectors_P1_P6 (J8.K4)
BP_IO.LVDS_P4: EEM_Connectors (R126.1), CPCIS_Connectors_P1_P6 (J8.H4)
BP_IO.LVDS_P5: EEM_Connectors (R127.1), CPCIS_Connectors_P1_P6 (J8.J5)
BP_IO.LVDS_P6: EEM_Connectors (R128.1), CPCIS_Connectors_P1_P6 (J8.G5)
BP_IO.LVDS_P7: EEM_Connectors (R129.1), CPCIS_Connectors_P1_P6 (J8.E6)
BP_IO.LVDS_P8: EEM_Connectors (R130.1), CPCIS_Connectors_P1_P6 (J8.B6)
BP_IO.LVDS_P9: EEM_Connectors (R131.1), CPCIS_Connectors_P1_P6 (J8.K6)
BP_IO.LVDS_P10: EEM_Connectors (R132.1), CPCIS_Connectors_P1_P6 (J8.H6)
BP_IO.LVDS_P11: EEM_Connectors (R133.1), CPCIS_Connectors_P1_P6 (J9.D1)
CH0_A0: Sampler (IC19.15), U_Input_channel (IC2A.4)
CH0_A1: Sampler (IC19.1), U_Input_channel (IC2A.5)
CH1_A0: Sampler (IC19.2), U_Input_channel (IC2B.4)
CH1_A1: Sampler (IC19.3), U_Input_channel (IC2B.5)
CH2_A0: Sampler (IC19.4), U_Input_channel (IC2C.4)
CH2_A1: Sampler (IC19.5), U_Input_channel (IC2C.5)
CH3_A0: Sampler (IC19.6), U_Input_channel (IC2D.4)
CH3_A1: Sampler (IC19.7), U_Input_channel (IC2D.5)
CH4_A0: Sampler (IC20.15), U_Input_channel (IC2E.4)
CH4_A1: Sampler (IC20.1), U_Input_channel (IC2E.5)
CH5_A0: Sampler (IC20.2), U_Input_channel (IC2F.4)
CH5_A1: Sampler (IC20.3), U_Input_channel (IC2F.5)
CH6_A0: Sampler (IC20.4), U_Input_channel (IC2G.4)
CH6_A1: Sampler (IC20.5), U_Input_channel (IC2G.5)
CH7_A0: Sampler (IC20.6), U_Input_channel (IC2H.4)
CH7_A1: Sampler (IC20.7), U_Input_channel (IC2H.5)
EEM0_I2C.SCL: EEM_Connectors (6 pins), DIOT_Power_Supplies (IC40.2)
EEM0_I2C.SDA: EEM_Connectors (6 pins), DIOT_Power_Supplies (IC40.1)
IN_0_N: ADC_8CH (IC36.47), U_Input_channel (C4A.2 C6A.2 R6A.2)
IN_0_P: ADC_8CH (IC36.48), U_Input_channel (C6A.1 C7A.1 R12A.2)
IN_1_N: ADC_8CH (IC36.50), U_Input_channel (C4B.2 C6B.2 R6B.2)
IN_1_P: ADC_8CH (IC36.51), U_Input_channel (C6B.1 C7B.1 R12B.2)
IN_2_N: ADC_8CH (IC36.1), U_Input_channel (C4C.2 C6C.2 R6C.2)
IN_2_P: ADC_8CH (IC36.2), U_Input_channel (C6C.1 C7C.1 R12C.2)
IN_3_N: ADC_8CH (IC36.4), U_Input_channel (C4D.2 C6D.2 R6D.2)
IN_3_P: ADC_8CH (IC36.5), U_Input_channel (C6D.1 C7D.1 R12D.2)
IN_4_N: ADC_8CH (IC36.10), U_Input_channel (C4E.2 C6E.2 R6E.2)
IN_4_P: ADC_8CH (IC36.11), U_Input_channel (C6E.1 C7E.1 R12E.2)
IN_5_N: ADC_8CH (IC36.13), U_Input_channel (C4F.2 C6F.2 R6F.2)
IN_5_P: ADC_8CH (IC36.14), U_Input_channel (C6F.1 C7F.1 R12F.2)
IN_6_N: ADC_8CH (IC36.16), U_Input_channel (C4G.2 C6G.2 R6G.2)
IN_6_P: ADC_8CH (IC36.17), U_Input_channel (C6G.1 C7G.1 R12G.2)
IN_7_N: ADC_8CH (IC36.19), U_Input_channel (C4H.2 C6H.2 R6H.2)
IN_7_P: ADC_8CH (IC36.20), U_Input_channel (C6H.1 C7H.1 R12H.2)
NetD10_1: ADC_8CH (IC33.1 IC34.1), Supply_Sampler (D10.1 IC28.7 R69.1 R157.1)
NetIC7_5: ADC_8CH (IC36.24), EEM_Connectors (IC7.5)
NetR102_1: Supply_Sampler (R157.2), CPCIS_Connectors_P1_P6 (R102.1 T10.1)
~{OE}: Sampler (IC19.13 IC20.13), Supply_Sampler (IC27.7 R65.2)
PGIA-CS: Sampler (IC19.12 IC20.12), EEM_Connectors (IC11.5)
PGIA-MISO: Sampler (IC20.9), EEM_Connectors (IC10.5)
PGIA-MOSI: Sampler (IC19.14), EEM_Connectors (IC9.5)
PGIA-SCK: Sampler (IC19.11 IC20.11), EEM_Connectors (IC8.5)
PSU_EN: Supply_Sampler (IC31.3), DIOT_Power_Supplies (R115.1 R116.2), CPCIS_Connectors_P1_P6 (R111.2)
SDR_MODE: ADC_8CH (T9.1), EEM_Connectors (IC6.5)
SERVMOD_3V3: EEM_Connectors (IC46.5 IC46.13), CPCIS_Connectors_P1_P6 (R98.1 R101.2)
TERM_STAT0: Sampler (R25.2 T1.1), EEM_Connectors (IC3.4), U_Input_channel (SW1A.2)
TERM_STAT1: Sampler (R27.2 T2.1), EEM_Connectors (IC3.5), U_Input_channel (SW1B.2)
TERM_STAT2: Sampler (R29.2 T3.1), EEM_Connectors (IC3.6), U_Input_channel (SW1C.2)
TERM_STAT3: Sampler (R31.2 T4.1), EEM_Connectors (IC3.7), U_Input_channel (SW1D.2)
TERM_STAT4: Sampler (R33.2 T5.1), EEM_Connectors (IC3.9), U_Input_channel (SW1E.2)
TERM_STAT5: Sampler (R36.2 T6.1), EEM_Connectors (IC3.10), U_Input_channel (SW1F.2)
TERM_STAT6: Sampler (R39.2 T7.1), EEM_Connectors (IC3.11), U_Input_channel (SW1G.2)
TERM_STAT7: Sampler (R43.2 T8.1), EEM_Connectors (IC3.12), U_Input_channel (SW1H.2)

## Assembly variants
STD: not fitted C17A C17B C17C C17D C17E C17F C17G C17H C47 C80 C83 C116 CLIP6 CLIP7 CLIP11 CLIP12 CLIP13 CLIP14 CLIP15 CLIP16 CLIP17 CLIP18 CLIP19 CLIP20 CLIP21 CLIP22 CLIP23 CLIP24 CLIP25 CLIP26 IC1 IC4 IC7 IC34 R7
4HP: all parts fitted